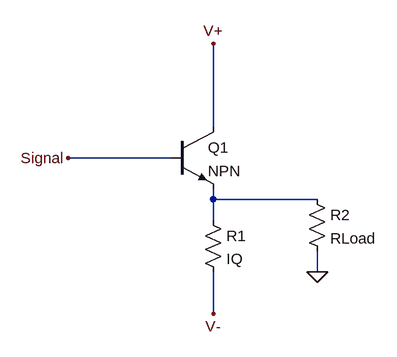
[diagram p0: schematic output_stage.asc]
output_stage.asc, the LTspice schematic file:
Version 4
SHEET 1 880 680
WIRE 256 96 256 -32
WIRE 192 144 32 144
WIRE 256 208 256 192
WIRE 416 208 256 208
WIRE 256 240 256 208
WIRE 416 320 416 288
WIRE 256 384 256 320
FLAG 416 320 0
FLAG 256 -32 V+
FLAG 256 384 V-
FLAG 32 144 Signal
SYMBOL npn 192 96 R0
SYMATTR InstName Q1
SYMBOL res 240 224 R0
SYMATTR InstName R1
SYMATTR Value IQ
SYMBOL res 400 192 R0
SYMATTR InstName R2
SYMATTR Value RLoad

The netlist it stands for:
* output_stage.asc
Q1 V+ Signal N001 0 NPN
R1 N001 V- IQ
R2 N001 0 RLoad
.model NPN NPN
.model PNP PNP
.lib standard.bjt
.backanno
.end